# Altium schematic sheet Shiftregister.SchDoc: S88-N Occupancy Detector
size A4; DrawnBy: Sem Kirkels; DocumentNumber: 23P001S02; Revision: V1; SheetNumber: 2; SheetTotal: 6
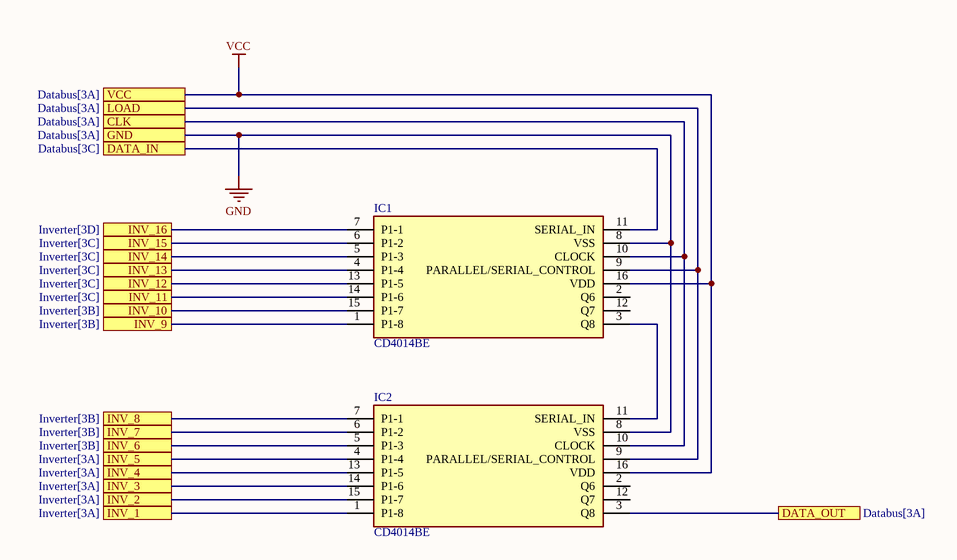
[diagram p0: Shiftregister.SchDoc]

## Parts
IC1  CD4014BE  [CD4014]
IC2  CD4014BE  [CD4014]

## Ports
CLK (see Databus[3A]), DATA_IN (see Databus[3C]), DATA_OUT (see Databus[3A]), GND (see Databus[3A]), INV_1 (see Inverter[3A]), INV_2 (see Inverter[3A]), INV_3 (see Inverter[3A]), INV_4 (see Inverter[3A]), INV_5 (see Inverter[3A]), INV_6 (see Inverter[3B]), INV_7 (see Inverter[3B]), INV_8 (see Inverter[3B]), INV_9 (see Inverter[3B]), INV_10 (see Inverter[3B]), INV_11 (see Inverter[3C]), INV_12 (see Inverter[3C]), INV_13 (see Inverter[3C]), INV_14 (see Inverter[3C]), INV_15 (see Inverter[3C]), INV_16 (see Inverter[3D]), LOAD (see Databus[3A]), VCC (see Databus[3A])

## Nets
GND: IC1.8(VSS) IC2.8(VSS) ; port GND
VCC: IC1.16(VDD) IC2.16(VDD) ; port VCC
CLK: IC1.10(CLOCK) IC2.10(CLOCK) ; port CLK
DATA_IN: IC1.11(SERIAL_IN) ; port DATA_IN
DATA_OUT: IC2.3(Q8) ; port DATA_OUT
INV_1: IC2.1(P1-8) ; port INV_1
INV_2: IC2.15(P1-7) ; port INV_2
INV_3: IC2.14(P1-6) ; port INV_3
INV_4: IC2.13(P1-5) ; port INV_4
INV_5: IC2.4(P1-4) ; port INV_5
INV_6: IC2.5(P1-3) ; port INV_6
INV_7: IC2.6(P1-2) ; port INV_7
INV_8: IC2.7(P1-1) ; port INV_8
INV_9: IC1.1(P1-8) ; port INV_9
INV_10: IC1.15(P1-7) ; port INV_10
INV_11: IC1.14(P1-6) ; port INV_11
INV_12: IC1.13(P1-5) ; port INV_12
INV_13: IC1.4(P1-4) ; port INV_13
INV_14: IC1.5(P1-3) ; port INV_14
INV_15: IC1.6(P1-2) ; port INV_15
INV_16: IC1.7(P1-1) ; port INV_16
LOAD: IC1.9(PARALLEL/SERIAL_CONTROL) IC2.9(PARALLEL/SERIAL_CONTROL) ; port LOAD
NetIC1_3: IC1.3(Q8) IC2.11(SERIAL_IN)

Not connected (* = marked no-connect by the designer): IC1 2(Q6) 12(Q7); IC2 2(Q6) 12(Q7)

## Library data of the parts
IC1 IC2 = CD4014BE: Integrated Circuit; Manufacturer_Name: Texas Instruments; Datasheet Link: http://www.ti.com/lit/gpn/cd4014b; Height: 5.08mm; Manufacturer_Part_Number: CD4014BE; Mouser Part Number: 595-CD4014BE; Mouser Price/Stock: https://www.mouser.co.uk/ProductDetail/Texas-Instruments/CD4014BE?qs=8k%2FZSzWMuCOtKecuorM4CQ%3D%3D; Arrow Part Number: CD4014BE; Arrow Price/Stock: https://www.arrow.com/en/products/cd4014be/texas-instruments?region=nac